# EasyEDA schematic sch.json
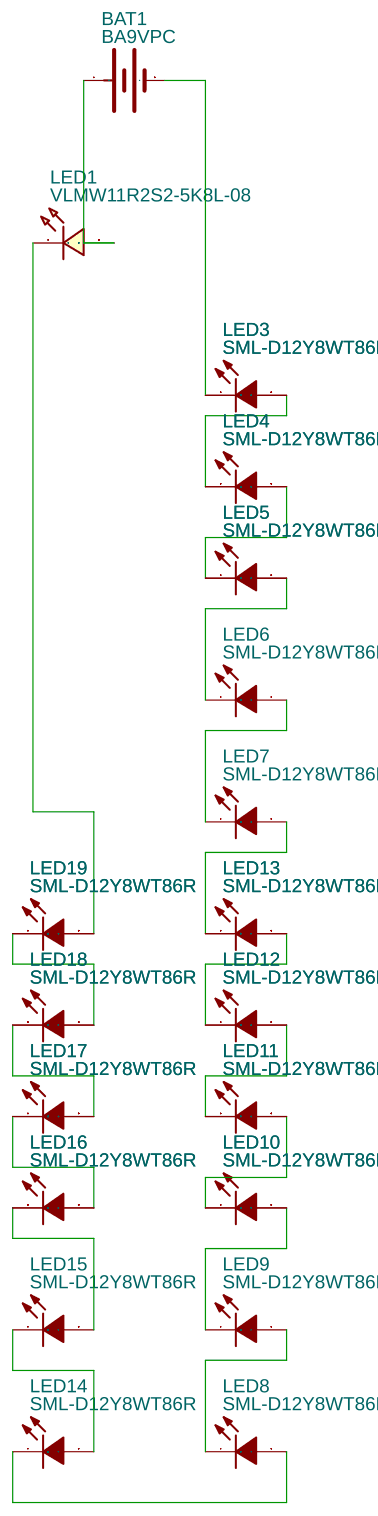
[diagram p0: schematic sheet]

## Parts
BAT1  BA9VPC  [BAT-TH_BA9VPC]
LED1  VLMW11R2S2-5K8L-08  [LED0603-RD_WHITE]
LED3  SML-D12Y8WT86R  [LED0603-RD-YELLOW]
LED4  SML-D12Y8WT86R  [LED0603-RD-YELLOW]
LED5  SML-D12Y8WT86R  [LED0603-RD-YELLOW]
LED6  SML-D12Y8WT86R  [LED0603-RD-YELLOW]
LED7  SML-D12Y8WT86R  [LED0603-RD-YELLOW]
LED8  SML-D12Y8WT86R  [LED0603-RD-YELLOW]
LED9  SML-D12Y8WT86R  [LED0603-RD-YELLOW]
LED10  SML-D12Y8WT86R  [LED0603-RD-YELLOW]
LED11  SML-D12Y8WT86R  [LED0603-RD-YELLOW]
LED12  SML-D12Y8WT86R  [LED0603-RD-YELLOW]
LED13  SML-D12Y8WT86R  [LED0603-RD-YELLOW]
LED14  SML-D12Y8WT86R  [LED0603-RD-YELLOW]
LED15  SML-D12Y8WT86R  [LED0603-RD-YELLOW]
LED16  SML-D12Y8WT86R  [LED0603-RD-YELLOW]
LED17  SML-D12Y8WT86R  [LED0603-RD-YELLOW]
LED18  SML-D12Y8WT86R  [LED0603-RD-YELLOW]
LED19  SML-D12Y8WT86R  [LED0603-RD-YELLOW]

## Library data of the parts
BAT1 = BA9VPC: Supplier: LCSC; Supplier Part: C5556545; Manufacturer: MPD(Memory Protection Devices); JLCPCB Part Class: Extended Part; Contributor: lcsc
LED1 = VLMW11R2S2-5K8L-08: Contributor: LCSC; Supplier: LCSC; Supplier Part: C511048; Manufacturer: VISHAY(威世); JLCPCB Part Class: Extended Part
LED3-LED19 = SML-D12Y8WT86R: Contributor: LCSC; Supplier: LCSC; Supplier Part: C600870; Manufacturer: ROHM(罗姆); JLCPCB Part Class: Extended Part

## Nets
Net-(BAT1-1): BAT1.1(+) LED1.2
Net-(BAT1-2): BAT1.2(-) LED3.1(C)
Net-(LED1-1): LED1.1 LED19.2(A)
Net-(LED3-2): LED3.2(A) LED4.1(C)
Net-(LED4-2): LED4.2(A) LED5.1(C)
Net-(LED5-2): LED5.2(A) LED6.1(C)
Net-(LED6-2): LED6.2(A) LED7.1(C)
Net-(LED7-2): LED7.2(A) LED13.1(C)
Net-(LED8-1): LED8.1(C) LED9.2(A)
Net-(LED8-2): LED8.2(A) LED14.1(C)
Net-(LED9-1): LED9.1(C) LED10.2(A)
Net-(LED10-1): LED10.1(C) LED11.2(A)
Net-(LED11-1): LED11.1(C) LED12.2(A)
Net-(LED12-1): LED12.1(C) LED13.2(A)
Net-(LED14-2): LED14.2(A) LED15.1(C)
Net-(LED15-2): LED15.2(A) LED16.1(C)
Net-(LED16-2): LED16.2(A) LED17.1(C)
Net-(LED17-2): LED17.2(A) LED18.1(C)
Net-(LED18-2): LED18.2(A) LED19.1(C)
